# Altium schematic sheet Power.SchDoc
size A
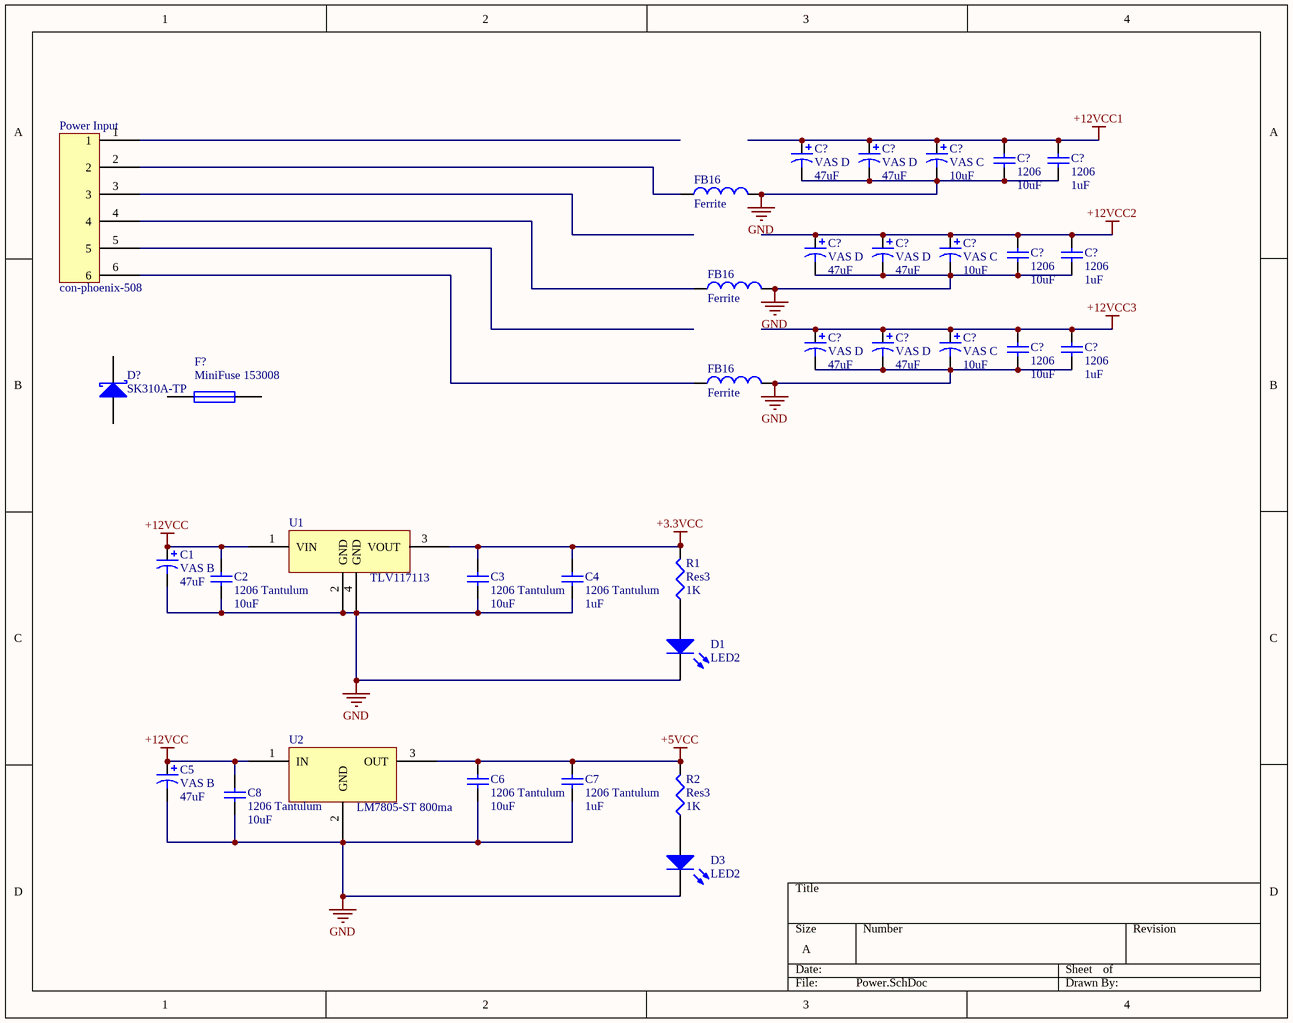
[diagram p0: Power.SchDoc]

## Parts
(Parts that share a designator on the sheet are numbered #1, #2 ... from top to bottom, then left to right.)
C1  VAS B  value 47uF  [Panasonic VS B]
C2  1206 Tantulum  value 10uF  [C1206]
C3  1206 Tantulum  value 10uF  [C1206]
C4  1206 Tantulum  value 1uF  [C1206]
C5  VAS B  value 47uF  [Panasonic VS B]
C6  1206 Tantulum  value 10uF  [C1206]
C7  1206 Tantulum  value 1uF  [C1206]
C8  1206 Tantulum  value 10uF  [C1206]
C?#1  VAS D  value 47uF  [Panasonic VS D]
C?#2  VAS D  value 47uF  [Panasonic VS D]
C?#3  VAS C  value 10uF  [Panasonic VS C]
C?#4  1206  value 10uF  [C1206]
C?#5  1206  value 1uF  [C1206]
C?#6  VAS D  value 47uF  [Panasonic VS D]
C?#7  VAS D  value 47uF  [Panasonic VS D]
C?#8  VAS C  value 10uF  [Panasonic VS C]
C?#9  1206  value 10uF  [C1206]
C?#10  1206  value 1uF  [C1206]
C?#11  VAS D  value 47uF  [Panasonic VS D]
C?#12  VAS D  value 47uF  [Panasonic VS D]
C?#13  VAS C  value 10uF  [Panasonic VS C]
C?#14  1206  value 10uF  [C1206]
C?#15  1206  value 1uF  [C1206]
D1  LED2  [SM 0805 polarized]
D3  LED2  [SM 0805 polarized]
D?  SK310A-TP  [SK310A-TP]
F?  MiniFuse 153008  [TinyFuseATO_Carrier]
FB16#1  Ferrite  [SM 0805 - gap trimmed]
FB16#2  Ferrite  [SM 0805 - gap trimmed]
FB16#3  Ferrite  [SM 0805 - gap trimmed]
Power_Input  con-phoenix-508  [con-phoenix-508]
R1  Res3  value 1K  [SM 0805 - gap trimmed]
R2  Res3  value 1K  [SM 0805 - gap trimmed]
U1  TLV117113  [TLV117112]
U2  LM7805-ST 800ma  [DPAK-3]

## Nets
+3.3VCC: C3.2 C4.2 R1.2 U1.3(VOUT)
+5VCC: C6.2 C7.2 R2.2 U2.3(OUT)
+12VCC: C1.1 C2.2 C5.1 C8.2 U1.1(VIN) U2.1(IN)
+12VCC1: C?#1.1 C?#2.1 C?#3.1 C?#4.2 C?#5.2
+12VCC2: C?#6.1 C?#7.1 C?#8.1 C?#9.2 C?#10.2
+12VCC3: C?#11.1 C?#12.1 C?#13.1 C?#14.2 C?#15.2
GND: C1.2 C2.1 C3.1 C4.1 C5.2 C6.1 C7.1 C8.1 C?#1.2 C?#2.2 C?#3.2 C?#4.1 C?#5.1 C?#6.2 C?#7.2 C?#8.2 C?#9.1 C?#10.1 C?#11.2 C?#12.2 C?#13.2 C?#14.1 C?#15.1 D1.1(A) D3.1(A) FB16#1.2 FB16#2.2 FB16#3.2 U1.2(GND) U1.4(GND) U2.2(GND)
NetD1_2: D1.2(K) R1.1
NetD3_2: D3.2(K) R2.1
NetFB16#1_1: FB16#1.1 Power_Input.2
NetFB16#2_1: FB16#2.1 Power_Input.4
NetFB16#3_1: FB16#3.1 Power_Input.6

Not connected (* = marked no-connect by the designer): D? 1(A) 2(K); F? 1 2; Power_Input 1 3 5

## Library data of the parts
C1 C5 C?#1-C?#3 C?#6-C?#8 C?#11-C?#13 = Cap Pol1: Polarized Capacitor (Radial); Published: 8-Jun-2000; LatestRevisionDate: 17-Jul-2002; LatestRevisionNote: Re-released for DXP Platform.; PackageReference: RB7.6-15; Publisher: Altium Limited; PackageDescription: Polarized Capacitor (Radial); 2 Leads
C2-C4 C6-C8 C?#4 C?#5 C?#9 C?#10 C?#14 C?#15 = Cap Semi: Capacitor (Semiconductor SIM Model); Published: 8-Jun-2000; LatestRevisionDate: 29-May-2009; LatestRevisionNote: IPC-7351 Footprint Added.; PackageReference: C1206; Publisher: Altium Limited; PackageDescription: Chip Capacitor
D1 D3 = LED2: Typical RED, GREEN, YELLOW, AMBER GaAs LED; Published: 8-Jun-2000; LatestRevisionDate: 17-Jul-2002; LatestRevisionNote: Re-released for DXP Platform.; PackageVersion: Feb-2002; PackageReference: 3.2X1.6X1.1; Publisher: Altium Limited; PackageDescription: SM LED; 2 Flat Leads
D? = D Schottky: Schottky Diode; Published: 8-Jun-2000; LatestRevisionDate: 17-Jul-2002; LatestRevisionNote: Re-released for DXP Platform.; PackageReference: SMB; Publisher: Altium Limited; PackageDescription: DO-214-AA/SMB; 2 C-Bend Leads; Body 5.3 x 3.6 mm, inc. leads (LxW); Code_JEDEC: DO-214-AA
F? = Fuse 1: Fuse; Published: 8-Jun-2000; LatestRevisionDate: 17-Jul-2002; LatestRevisionNote: Re-released for DXP Platform.; PackageReference: PIN-W2/E2.8; Publisher: Altium Limited; PackageDescription: Thru-Hole; 2 Leads
FB16#1-FB16#3 = Inductor: Code_IEC: 1005; Published: 8-Jun-2000; LatestRevisionDate: 17-Jul-2002; LatestRevisionNote: Re-released for DXP Platform.; PackageReference: 0402-A; Publisher: Altium Limited; Code_JEITA: 0402
R1 R2 = Res3: Resistor; Published: 8-Jun-2000; LatestRevisionDate: 29-May-2009; LatestRevisionNote: IPC-7351 Footprint Added.; PackageReference: J1-0603; Publisher: Altium Limited; PackageDescription: Chip Resistor
U1 = TLV117112: Linear Regulator
U2 = LM708-ST 800ma